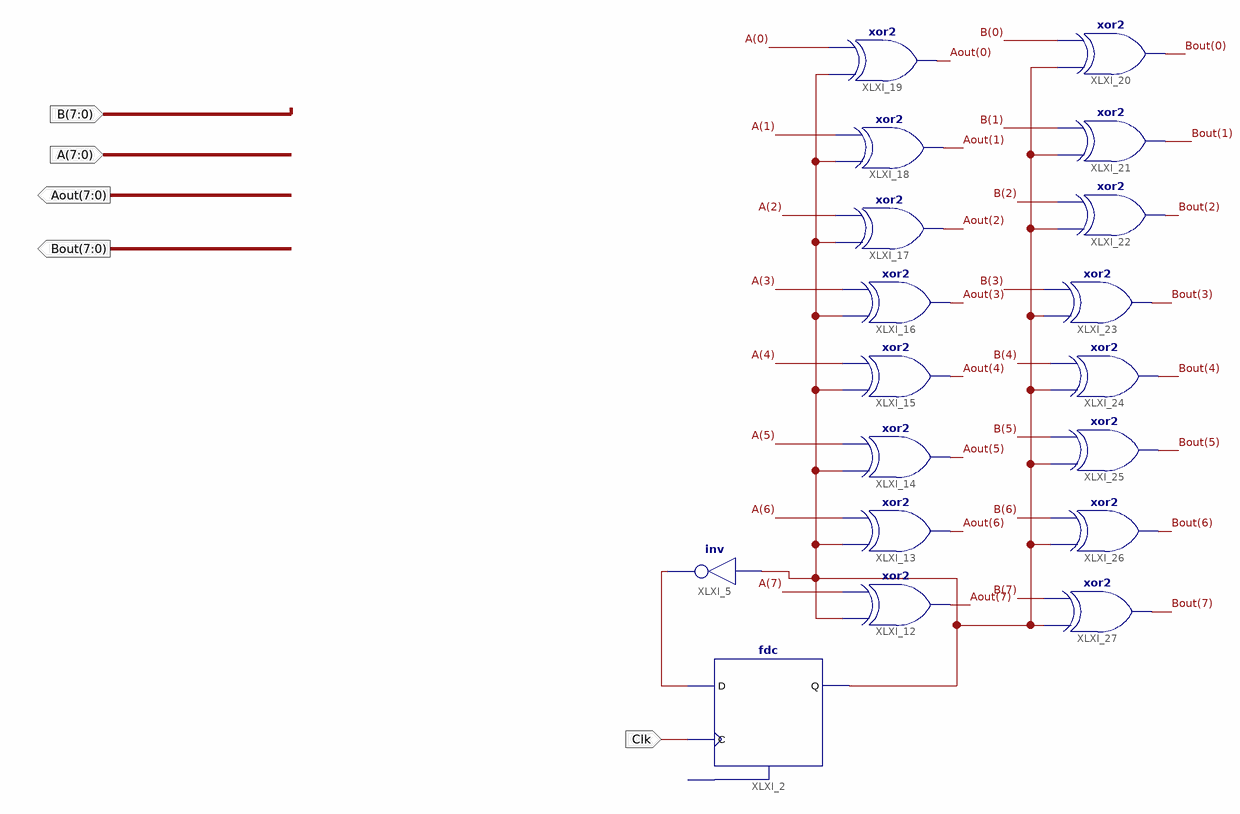
[diagram p0: schematic sheet 1]
// Xilinx ISE schematic first_b.sch (spartan3) as structural Verilog: 18 symbols, 5 ports
module first_b (
  input  Clk,
  input  [7:0] B,
  input  [7:0] A,
  output [7:0] Aout,
  output [7:0] Bout
);

  wire XLXN_3, XLXN_35;

  not XLXI_5 (XLXN_3, XLXN_35);
  fdc XLXI_2 (.C(Clk), .D(XLXN_3), .Q(XLXN_35));  // open: CLR
  xor XLXI_12 (Aout[7], XLXN_35, A[7]);
  xor XLXI_13 (Aout[6], XLXN_35, A[6]);
  xor XLXI_14 (Aout[5], XLXN_35, A[5]);
  xor XLXI_15 (Aout[4], XLXN_35, A[4]);
  xor XLXI_16 (Aout[3], XLXN_35, A[3]);
  xor XLXI_17 (Aout[2], XLXN_35, A[2]);
  xor XLXI_18 (Aout[1], XLXN_35, A[1]);
  xor XLXI_19 (Aout[0], XLXN_35, A[0]);
  xor XLXI_20 (Bout[0], XLXN_35, B[0]);
  xor XLXI_21 (Bout[1], XLXN_35, B[1]);
  xor XLXI_22 (Bout[2], XLXN_35, B[2]);
  xor XLXI_23 (Bout[3], XLXN_35, B[3]);
  xor XLXI_24 (Bout[4], XLXN_35, B[4]);
  xor XLXI_25 (Bout[5], XLXN_35, B[5]);
  xor XLXI_26 (Bout[6], XLXN_35, B[6]);
  xor XLXI_27 (Bout[7], XLXN_35, B[7]);
endmodule
